# Altium project MB1136.PrjPCB
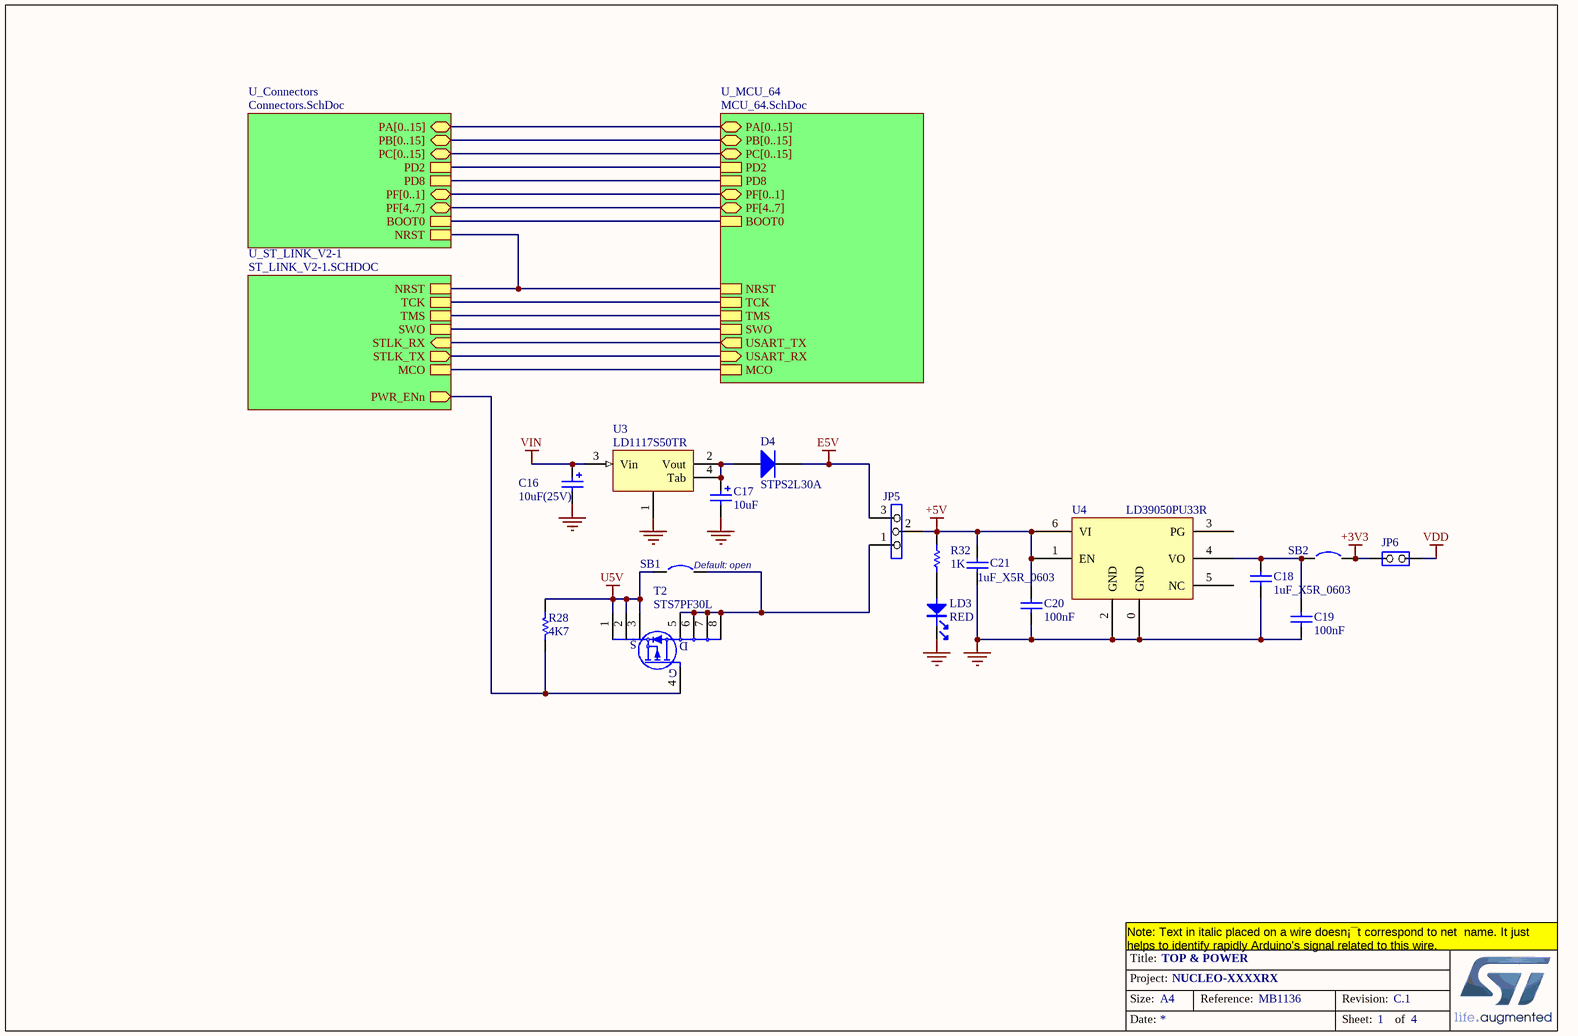
[diagram p0: MB1136.SchDoc]
4 sheets, 172 parts. Net scope: hierarchical (ports join the sheet entries above them; power ports are global).
Board files: MB1136.PcbDoc, Nucleo_64_mechanic_revC.PcbDoc
Sheets:
  MB1136.SchDoc
    U_ST_LINK_V2-1 = ST_LINK_V2-1.SCHDOC
    U_Connectors = Connectors.SchDoc
    U_MCU_64 = MCU_64.SchDoc

## Sheet MB1136.SchDoc: TOP & POWER
size A4; DocumentNumber: MB1136; Revision: C.1; SheetNumber: 1; SheetTotal: 4; Project: NUCLEO-XXXXRX

### Parts
C16  10uF(25V)  [TAN-B]
C17  10uF  [TAN-A]
C18  1uF_X5R_0603  [0603C]
C19  100nF  [0603C]
C20  100nF  [0603C]
C21  1uF_X5R_0603  [0603C]
D4  STPS2L30A  [SMA]
JP5  (no value)  [SIP3]
JP6  (no value)  [SIP2/2.54]
LD3  RED  [0603D]
R28  4K7  [0603R]
R32  1K  [0603R]
SB1  Circuit Breaker  [JP2_SMD]  (value not drawn)
SB2  Circuit Breaker  [JP2_SMD]  (value not drawn)
T2  STS7PF30L  [SO8]
U3  LD1117S50TR  [SOT-223]
U4  LD39050PU33R  [DFN6(3X3)]

### Sub-sheets
U_Connectors = Connectors.SchDoc: PA[0..15] (bidir), PB[0..15] (bidir), PC[0..15] (bidir), PF[4..7] (bidir), PD2, PD8, PF[0..1] (bidir), NRST, BOOT0
U_MCU_64 = MCU_64.SchDoc: NRST, MCO, USART_RX (in), USART_TX (out), PA[0..15] (bidir), PB[0..15] (bidir), PC[0..15] (bidir), PF[4..7] (bidir), PD2, TCK, TMS, SWO, PD8, PF[0..1] (bidir), BOOT0
U_ST_LINK_V2-1 = ST_LINK_V2-1.SCHDOC: TMS, TCK, MCO, NRST, STLK_RX (in), STLK_TX (out), SWO, PWR_ENn (out)

### Nets
+3V3: JP6.1(COMMON) SB2.2
+5V: C20.2 C21.1 JP5.2 R32.2 U4.1(EN) U4.6(VI)
E5V: D4.2(K) JP5.3
GND: C16.2 C17.2 C18.2 C19.1 C20.1 C21.2 LD3.2 U3.1 U4.0(GND) U4.2(GND)
U5V: R28.1 SB1.1 T2.1(S) T2.2(S) T2.3(S)
VDD: JP6.2(NO)
VIN: C16.1 U3.3(Vin)
BOOT0: sheet U_Connectors/BOOT0, sheet U_MCU_64/BOOT0
MCO: sheet U_ST_LINK_V2-1/MCO, sheet U_MCU_64/MCO
NRST: sheet U_ST_LINK_V2-1/NRST, sheet U_Connectors/NRST, sheet U_MCU_64/NRST
PA13: sheet U_ST_LINK_V2-1/TMS, sheet U_MCU_64/TMS
PA14: sheet U_ST_LINK_V2-1/TCK, sheet U_MCU_64/TCK
PB3: sheet U_ST_LINK_V2-1/SWO, sheet U_MCU_64/SWO
PD2: sheet U_Connectors/PD2, sheet U_MCU_64/PD2
PD8: sheet U_Connectors/PD8, sheet U_MCU_64/PD8
NetC17_1: C17.1 D4.1(A) U3.2(Vout) U3.4(Tab)
NetC18_1: C18.1 C19.2 SB2.1 U4.4(VO)
NetJP5_1: JP5.1 SB1.2 T2.5(D) T2.6(D) T2.7(D) T2.8(D)
NetLD3_1: LD3.1 R32.1
NetR28_2: R28.2 T2.4(G) ; sheet U_ST_LINK_V2-1/PWR_ENn
NetSB13_1: sheet U_ST_LINK_V2-1/STLK_RX, sheet U_MCU_64/USART_TX
NetSB14_1: sheet U_ST_LINK_V2-1/STLK_TX, sheet U_MCU_64/USART_RX

Not connected (* = marked no-connect by the designer): U4 3(PG) 5(NC)

### Buses and harness runs
bus sheet U_Connectors/PA[0..15] = sheet U_MCU_64/PA[0..15]
bus sheet U_Connectors/PB[0..15] = sheet U_MCU_64/PB[0..15]
bus sheet U_Connectors/PC[0..15] = sheet U_MCU_64/PC[0..15]
bus sheet U_Connectors/PF[0..1] = sheet U_MCU_64/PF[0..1]
bus sheet U_Connectors/PF[4..7] = sheet U_MCU_64/PF[4..7]

### Notes on the sheet
- (near SB1) Default: open
- Note: Text in italic placed on a wire doesn¡¯t correspond to net  name. It just helps to identify rapidly Arduino's signal related to this wire.
- Title:
- Project:
- Size:
- Date:
- A4
- Reference:
- Sheet:
- Revision:
- of

### Library data of the parts
C16 C17 = Cap Pol1: Polarized Capacitor (Radial); Published: 8-Jun-2000; Revision: July-2002: Re-released for DXP Platform.; Publisher: Altium Limited; Value: 10uF
C18 C21 = CAP SMD 0603  X5R 1µF 25V 10%: 0603  X5R 1µF; Rated voltage: 25V; Tolerance: 10%; Manufacturer: *; Manufacturer P/N: *; Order code Farnell: 1288202RL; Value: 1µF; Power: *; Technology: X5R; Temperature  Factor: *; Temperature Max: +125°C; Temperature Min: -55°C; STS Code: *
C19 C20 = Capacitor_ST: Capacitor 0402 / 0603 / 0805; Revision: July-2002: Re-released for DXP Platform.; Value: 100nF
D4 = STPS2L30A: Manuf_1: STM; Provided: ST; Order: BAT60JFILM; ECCN_US/EU: EAR99/NEC; Revision: July-2002: Re-released for DXP Platform.; Manuf_Part_1: BAT60JFILM; Distrib: ST
JP5 = Jumper3
JP6 = JP2
LD3 = PHOTO
R28 = Res1: Resistor; Value: 1K; Published: 8-Jun-2000; Revision: July-2002: Re-released for DXP Platform.; Publisher: Altium Limited
R32 = Resistor_ST: Resistor 0402 / 0603 / 0805; Description: Resistor 0402 or 0603 or 0805; Value: 10K
SB1 SB2 = Circuit Breaker: Solder: NO; Published: 24-Mar-1999; Revision: July-2002: Re-released for DXP Platform.; Publisher: Altium Limited
U3 = LD1117
U4 = LD39050P

## Sheet ST_LINK_V2-1.SCHDOC: STLINK/V2-1
size A4; DocumentNumber: MB1136; Revision: C.1; SheetNumber: 3; SheetTotal: 4; Project: NUCLEO-XXXXRX
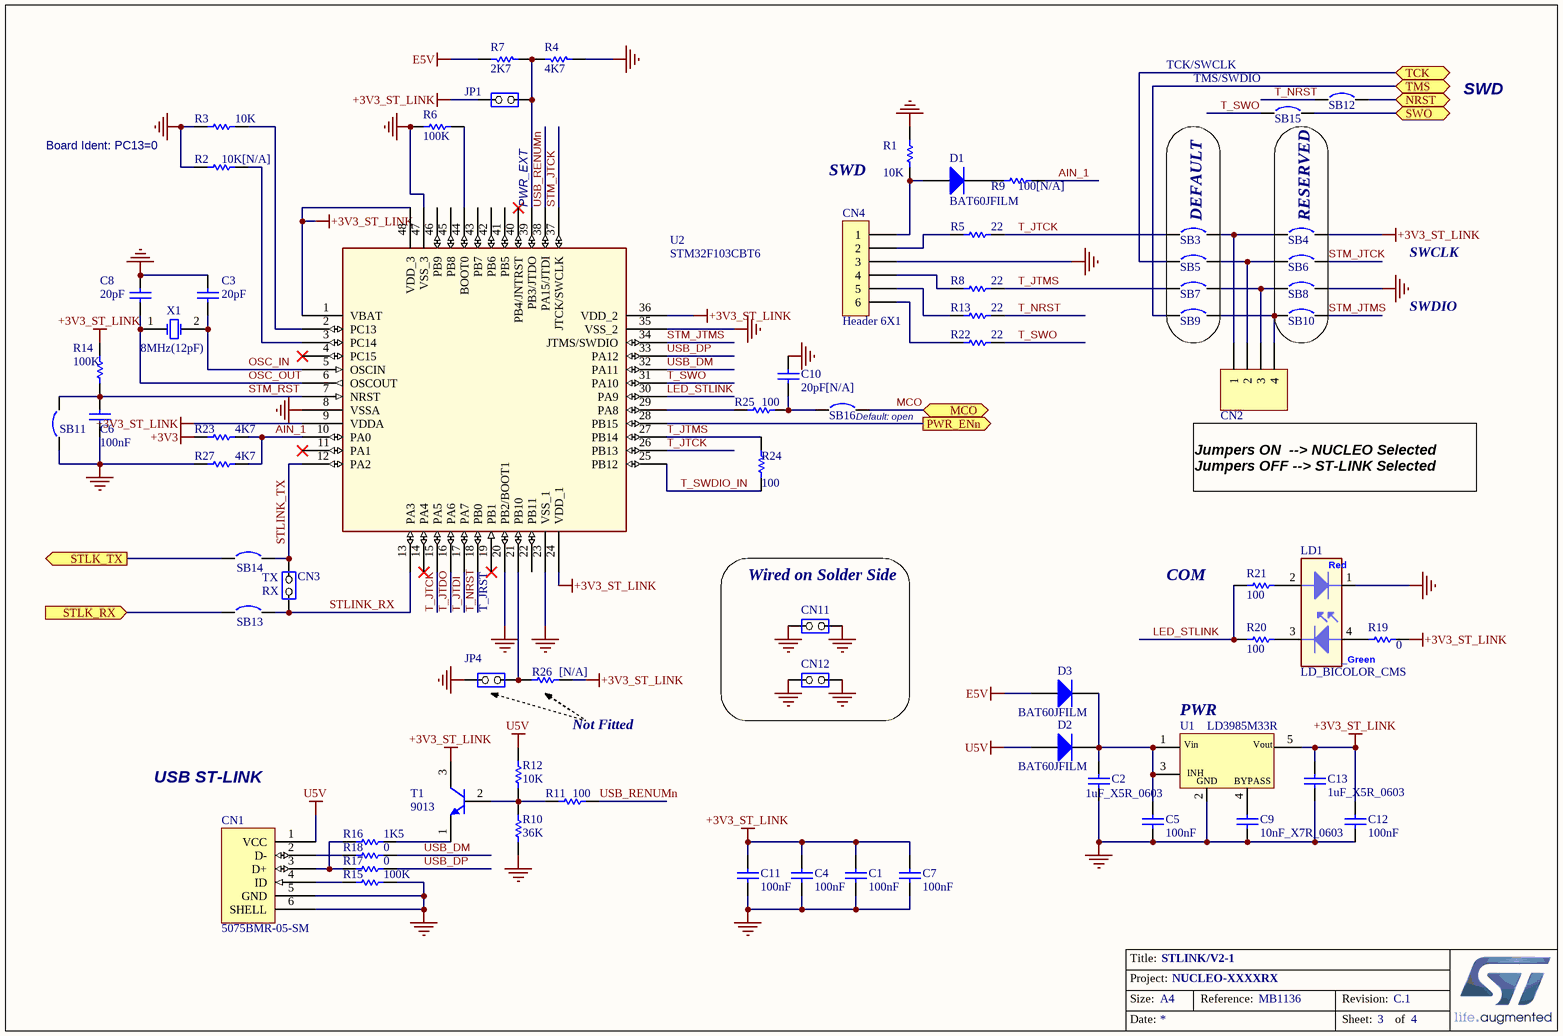
[diagram p1: ST_LINK_V2-1.SCHDOC]

### Parts
C1  100nF  [0603C]
C2  1uF_X5R_0603  [0603C]
C3  20pF  [0603C]
C4  100nF  [0603C]
C5  100nF  [0603C]
C6  100nF  [0603C]
C7  100nF  [0603C]
C8  20pF  [0603C]
C9  10nF_X7R_0603  [0603C]
C10  20pF[N/A]  [0603C]
C11  100nF  [0603C]
C12  100nF  [0603C]
C13  1uF_X5R_0603  [0603C]
CN1  5075BMR-05-SM  [USB-MINI-B-SMD]
CN2  Header 4  [1*4]  (value not drawn)
CN3  (no value)  [SIP2/2.54]
CN4  Header 6X1  [1*6P]
CN11  (no value)  [SIP2/2.54]
CN12  (no value)  [SIP2/2.54]
D1  BAT60JFILM  [SOD323/A]
D2  BAT60JFILM  [SOD323/A]
D3  BAT60JFILM  [SOD323/A]
JP1  (no value)  [SIP2/2.54]
JP4  (no value)  [SIP2/2.54]
LD1  LD_BICOLOR_CMS  [HSMF-A201]
R1  10K  [0603R]
R2  10K[N/A]  [0603R]
R3  10K  [0603R]
R4  4K7  [0603R]
R5  22  [0603R]
R6  100K  [0603R]
R7  2K7  [0603R]
R8  22  [0603R]
R9  100[N/A]  [0603R]
R10  36K  [0603R]
R11  100  [0603R]
R12  10K  [0603R]
R13  22  [0603R]
R14  100K  [0603R]
R15  100K  [0603R]
R16  1K5  [0603R]
R17  0  [0603R]
R18  0  [0603R]
R19  0  [0603R]
R20  100  [0603R]
R21  100  [0603R]
R22  22  [0603R]
R23  4K7  [0603R]
R24  100  [0603R]
R25  100  [0603R]
R26  [N/A]  [0603R]
R27  4K7  [0603R]
SB3  Circuit Breaker  [JP2_SMD]  (value not drawn)
SB4  Circuit Breaker  [JP2_SMD]  (value not drawn)
SB5  Circuit Breaker  [JP2_SMD]  (value not drawn)
SB6  Circuit Breaker  [JP2_SMD]  (value not drawn)
SB7  Circuit Breaker  [JP2_SMD]  (value not drawn)
SB8  Circuit Breaker  [JP2_SMD]  (value not drawn)
SB9  Circuit Breaker  [JP2_SMD]  (value not drawn)
SB10  Circuit Breaker  [JP2_SMD]  (value not drawn)
SB11  Circuit Breaker  [JP2_SMD]  (value not drawn)
SB12  Circuit Breaker  [JP2_SMD]  (value not drawn)
SB13  Circuit Breaker  [JP2_SMD]  (value not drawn)
SB14  Circuit Breaker  [JP2_SMD]  (value not drawn)
SB15  Circuit Breaker  [JP2_SMD]  (value not drawn)
SB16  Circuit Breaker  [JP2_SMD]  (value not drawn)
T1  9013  [SOT-23]
U1  LD3985M33R  [SOT-23-5L]
U2  STM32F103CBT6  [QFP48 7X7]
X1  8MHz(12pF)  [XTAL1]

### Blocks framed on the sheet
DEFAULT: SB3 SB5 SB7 SB9
RESERVED: SB4 SB6 SB8 SB10
Wired on Solder Side: CN11 CN12

### Ports
MCO, NRST, PWR_ENn (out), STLK_RX (in), STLK_TX (out), SWO, TCK, TMS

### Nets
+3V3: R23.1
+3V3_ST_LINK: C1.2 C4.2 C7.2 C11.2 C12.2 C13.1 JP1.1(COMMON) R14.2 R19.2 R26.1 SB4.2 T1.3(C) U1.5(Vout) U2.1(VBAT) U2.9(VDDA) U2.24(VDD_1) U2.36(VDD_2) U2.48(VDD_3)
E5V: D3.1(A) R7.1
GND: C1.1 C2.1 C3.2 C4.1 C5.1 C6.1 C7.1 C8.2 C9.1 C10.2 C11.1 C12.1 C13.2 CN1.5(GND) CN1.6(SHELL) CN4.3 CN11.1(COMMON) CN11.2(NO) CN12.1(COMMON) CN12.2(NO) JP4.1(COMMON) LD1.1 R1.2 R2.1 R3.1 R4.2 R6.1 R10.1 R15.2 R27.1 SB8.2 SB11.1 U1.2(GND) U2.8(VSSA) U2.20(PB2/BOOT1) U2.23(VSS_1) U2.35(VSS_2) U2.47(VSS_3)
U5V: CN1.1(VCC) D2.1(A) R12.2
AIN_1: R9.2 R23.2 R27.2 U2.10(PA0)
LED_STLINK: R20.1 R21.1 U2.30(PA9)
MCO: SB16.2 ; port MCO
NRST: SB12.2 ; port NRST
OSC_IN: C3.1 U2.5(OSCIN) X1.2(OSC2)
OSC_OUT: C8.1 U2.6(OSCOUT) X1.1(OSC1)
PA13: SB9.1 ; port TMS
PA14: SB5.1 ; port TCK
PB3: SB15.2 ; port SWO
STLINK_RX: CN3.1(COMMON) SB13.2 U2.13(PA3)
STLINK_TX: CN3.2(NO) SB14.2 U2.12(PA2)
STM_JTCK: SB6.2 U2.37(JTCK/SWCLK)
STM_JTMS: SB10.2 U2.34(JTMS/SWDIO)
STM_RST: C6.2 R14.1 SB11.2 U2.7(NRST)
T_JTCK: R5.2 SB3.1 U2.15(PA5) U2.26(PB13)
T_JTDI: U2.17(PA7)
T_JTDO: U2.16(PA6)
T_JTMS: R8.2 R24.2 SB7.1 U2.27(PB14)
T_NRST: R13.2 SB12.1 U2.18(PB0)
T_SWDIO_IN: R24.1 U2.25(PB12)
T_SWO: R22.2 SB15.1 U2.31(PA10)
USB_DM: R18.2 U2.32(PA11)
USB_DP: R17.2 U2.33(PA12)
USB_RENUMn: R11.2 U2.38(PA15/JTDI)
NetC2_2: C2.2 C5.2 D2.2(K) D3.2(K) U1.1(Vin) U1.3(CE)
NetC9_2: C9.2 U1.4(BYPASS)
NetC10_1: C10.1 R25.2 SB16.1
NetCN1_2: CN1.2(D-) R18.1
NetCN1_3: CN1.3(D+) R16.1 R17.1
NetCN1_4: CN1.4(ID) R15.1
NetCN2_1: CN2.1 SB3.2 SB4.1
NetCN2_2: CN2.2 SB5.2 SB6.1
NetCN2_3: CN2.3 SB7.2 SB8.1
NetCN2_4: CN2.4 SB9.2 SB10.1
NetCN4_1: CN4.1 D1.1(A) R1.1
NetCN4_2: CN4.2 R5.1
NetCN4_4: CN4.4 R8.1
NetCN4_5: CN4.5 R13.1
NetCN4_6: CN4.6 R22.1
NetD1_2: D1.2(K) R9.1
NetJP1_2: JP1.2(NO) R4.1 R7.2 U2.39(PB3/JTDO)
NetJP4_2: JP4.2(NO) R26.2 U2.21(PB10)
NetLD1_2: LD1.2 R21.2
NetLD1_3: LD1.3 R20.2
NetLD1_4: LD1.4 R19.1
NetR2_2: R2.2 U2.3(PC14)
NetR3_2: R3.2 U2.2(PC13)
NetR6_2: R6.2 U2.44(BOOT0)
NetR10_2: R10.2 R11.1 R12.1 T1.2(B)
NetR16_2: R16.2 T1.1(E)
NetR25_1: R25.1 U2.29(PA8)
NetR28_2: U2.28(PB15) ; port PWR_ENn
NetSB13_1: SB13.1 ; port STLK_RX
NetSB14_1: SB14.1 ; port STLK_TX

Not connected (* = marked no-connect by the designer): U2 4(PC15)* 11(PA1)* 14(PA4)* 19(PB1)* 22(PB11) 40(PB4/JNTRST)* 41(PB5) 42(PB6) 43(PB7) 45(PB8) 46(PB9)

### Notes on the sheet
- TCK/SWCLK
- (near SB15) TMS/SWDIO
- SWD
- Board Ident: PC13=0
- (near U2) PWR_EXT
- SWCLK
- SWDIO
- (near SB16) Default: open
- Jumpers ON  --> NUCLEO Selected
  Jumpers OFF --> ST-LINK Selected
- TX
- COM
- RX
- T_JRST
- (near U1) PWR
- USB ST-LINK
- Not Fitted
- Title:
- Project:
- Size:
- Date:
- A4
- Reference:
- Sheet:
- Revision:
- of
- (in symbol LD3985M33R) INH
- (in symbol LD_BICOLOR_CMS) Red; _Green

### Library data of the parts
C1 C4-C7 C11 C12 = Capacitor_ST: Capacitor 0402 / 0603 / 0805; Revision: July-2002: Re-released for DXP Platform.; Value: 100nF
C2 C13 = CAP SMD 0603  X5R 1µF 25V 10%: as C18 on sheet MB1136; Manufacturer: *; Manufacturer P/N: *; Order code Farnell: 1288202RL; Value: 1µF; Power: *; Technology: X5R; Temperature  Factor: *; Temperature Max: +125°C; Temperature Min: -55°C; STS Code: *
C3 C8 C10 = Capacitor_ST: Capacitor 0402 / 0603 / 0805; Value: 100nF; Revision: July-2002: Re-released for DXP Platform.
C9 = CAP SMD 0603  X7R 10000PF 50V 10%: 0603  X7R 10NF; Order code RS: 2040779; Rated voltage: 50V; Tolerance: 10%; Order code Farnell: 7569548RL; Value: 10NF; Power: *; Technology: X7R; Temperature Factor: *; Temperature Min: -55°C; Temperature Max: +125°C; STS Code: *
CN1 = USB-MINI-typeB connector: Manuf_Part_1: 5075BMR-05-SM; Order: 5075BMR-05-SM; Description: USB-MINI-typeB connector; ECCN: ????
CN2 = Header 4: Header, 4-Pin, Single row; Revision: 17-Jul-2002: Re-released for DXP Platform.; Publisher: Altium Limited
CN3 = JP2: Fitted: NO
CN4 = Header 6X1: Header, 6-Pin, Single row; LatestRevisionDate: 17-Jul-2002; LatestRevisionNote: Re-released for DXP Platform.; Publisher: Altium Limited
CN11 CN12 JP1 JP4 = JP2
D1-D3 = BAT60JFILM: Manuf_1: STM; Provided: ST; ECCN_US/EU: EAR99/NEC; Revision: July-2002: Re-released for DXP Platform.; Order: BAT60JFILM; Manuf_Part_1: BAT60JFILM; Distrib: ST
LD1 = LD_BICOLOR_CMS: Bicolor Led; Manuf_Part_1: HSMF-A201-A00J1; Manuf_1: Avago Technologies; Ref St: xxxxxx; cap_dec: ----; Distrib: RADIOSPARES
R1 R3 = Resistor_ST: Resistor 0402 / 0603 / 0805; Description: Resistor 0402 or 0603 or 0805; Value: 10K
R2 R23 R27 = Resistor_ST: Resistor 0402 / 0603 / 0805; Description: Resistor 0402 or 0603 or 0805; Value: 10K; Fitted: NO
R4 R7 R10 R12 R26 = Res1: Resistor; Value: 1K; Published: 8-Jun-2000; Revision: July-2002: Re-released for DXP Platform.; Publisher: Altium Limited
R5 R6 R8 R9 R11 R13-R22 R24 R25 = Resistor_ST: as R32 on sheet MB1136
SB3 SB5 SB7 SB9 SB11 SB13-SB16 = Circuit Breaker: Solder: NO; Published: 24-Mar-1999; Revision: July-2002: Re-released for DXP Platform.; Publisher: Altium Limited
SB4 SB6 SB8 SB10 SB12 = Circuit Breaker: Solder: YES; Published: 24-Mar-1999; Revision: July-2002: Re-released for DXP Platform.; Publisher: Altium Limited
T1 = NPN: NPN Bipolar Transistor; Code - JEDEC: TO-226-AA; Published: 8-Jun-2000; Revision: July-2002: Re-released for DXP Platform.; Publisher: Altium Limited
U1 = LD3985M33R: Ultra low drop-low noise BiCMOS voltage, regulators low ESR capacitors compatible; Manuf_1: STM; Provided: ST; Ref St: 9176161; ECCN_US/EU: EAR99/NEC; Manuf_Part_1: LD3985M33R; Distrib: ST; Order: LD3985M33R
U2 = STM32F103CBT6: Medium-density performance line ARM-based 32-bit MCU with 64KB Flash; Manuf_Part_1: STM32F103C8T6; Manuf_1: STM; Ref St: 9175981; Provided: ST; ECCN_US/EU: 3A991A2/NEC; Distrib: ST; Order: STM32F103C8T6
X1 = XTAL: Crystal Oscillator; Published: 8-Jun-2000; LatestRevisionDate: 17-Jul-2002; LatestRevisionNote: Re-released for DXP Platform.; PackageReference: R38; Publisher: Altium Limited

## Sheet Connectors.SchDoc: Extension connectors
size A4; DocumentNumber: MB1136; Revision: C.1; SheetNumber: 4; SheetTotal: 4; Project: NUCLEO-XXXXRX
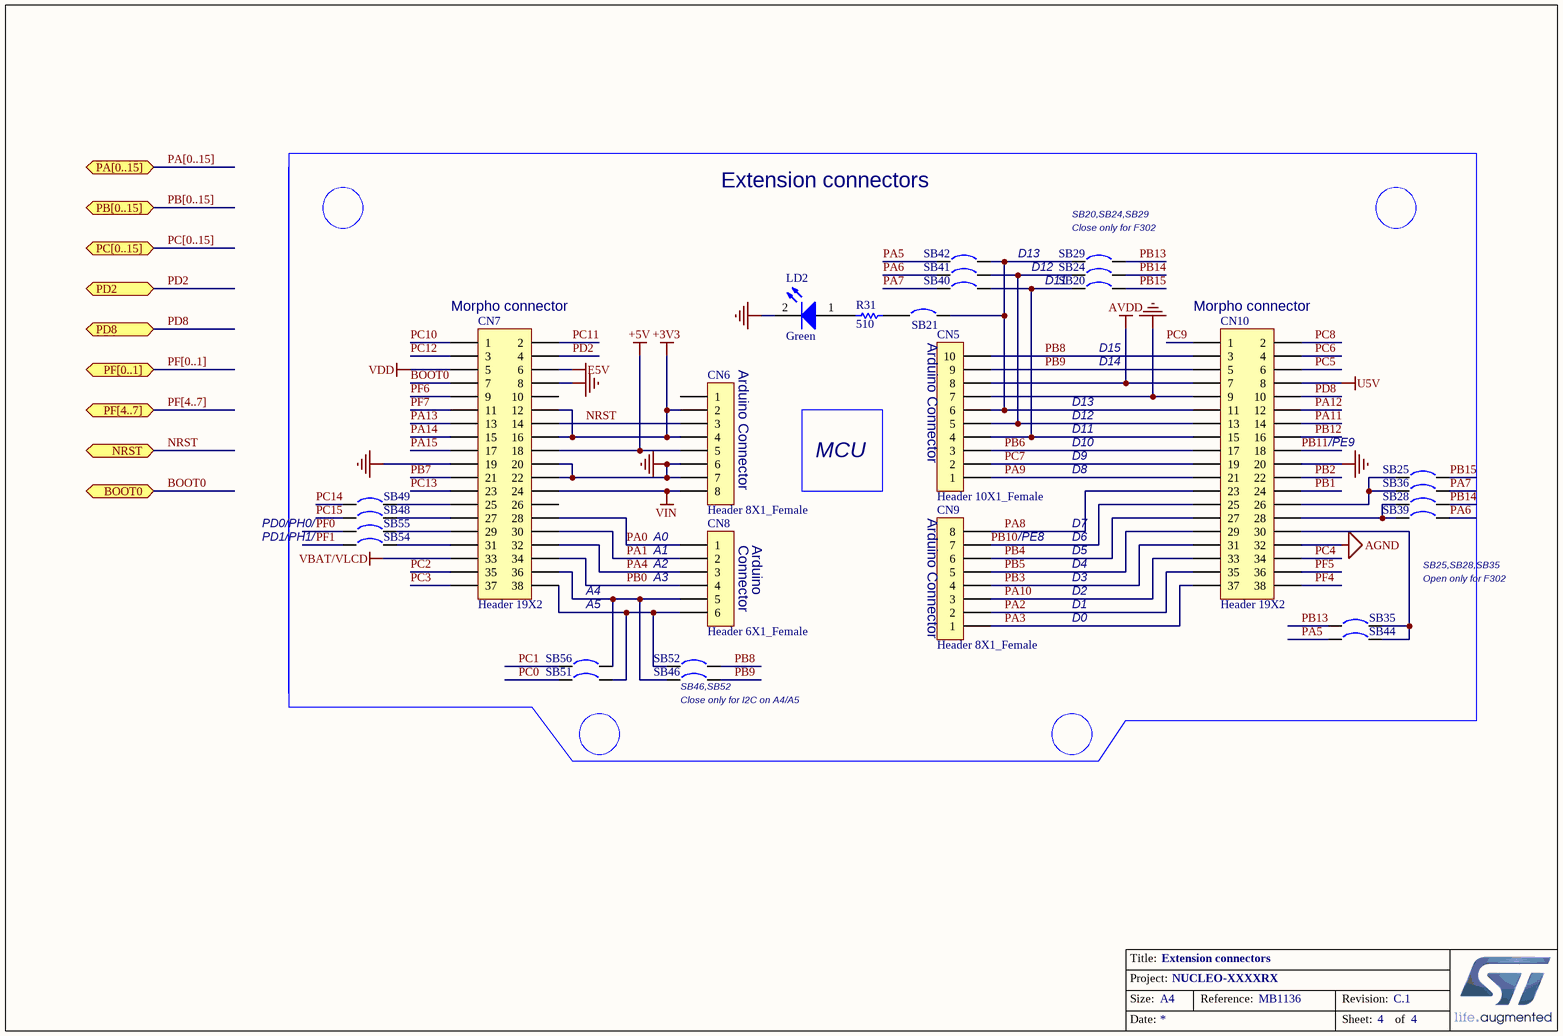
[diagram p2: Connectors.SchDoc]

### Parts
CN5  Header 10X1_Female  [1*10P_FEMALE]
CN6  Header 8X1_Female  [1*8P_FEMALE]
CN7  Header 19X2  [2*19P]
CN8  Header 6X1_Female  [1*6P_FEMALE]
CN9  Header 8X1_Female  [1*8P_FEMALE]
CN10  Header 19X2  [2*19P]
LD2  Green  [0603D]
R31  510  [0603R]
SB20  Circuit Breaker  [JP2_SMD]  (value not drawn)
SB21  Circuit Breaker  [JP2_SMD]  (value not drawn)
SB24  Circuit Breaker  [JP2_SMD]  (value not drawn)
SB25  Circuit Breaker  [JP2_SMD]  (value not drawn)
SB28  Circuit Breaker  [JP2_SMD]  (value not drawn)
SB29  Circuit Breaker  [JP2_SMD]  (value not drawn)
SB35  Circuit Breaker  [JP2_SMD]  (value not drawn)
SB36  Circuit Breaker  [JP2_SMD]  (value not drawn)
SB39  Circuit Breaker  [JP2_SMD]  (value not drawn)
SB40  Circuit Breaker  [JP2_SMD]  (value not drawn)
SB41  Circuit Breaker  [JP2_SMD]  (value not drawn)
SB42  Circuit Breaker  [JP2_SMD]  (value not drawn)
SB44  Circuit Breaker  [JP2_SMD]  (value not drawn)
SB46  Circuit Breaker  [JP2_SMD]  (value not drawn)
SB48  Circuit Breaker  [JP2_SMD]  (value not drawn)
SB49  Circuit Breaker  [JP2_SMD]  (value not drawn)
SB51  Circuit Breaker  [JP2_SMD]  (value not drawn)
SB52  Circuit Breaker  [JP2_SMD]  (value not drawn)
SB54  Circuit Breaker  [JP2_SMD]  (value not drawn)
SB55  Circuit Breaker  [JP2_SMD]  (value not drawn)
SB56  Circuit Breaker  [JP2_SMD]  (value not drawn)

### Ports
BOOT0, NRST, PA[0..15] (bidir), PB[0..15] (bidir), PC[0..15] (bidir), PD2, PD8, PF[0..1] (bidir), PF[4..7] (bidir)

### Nets
+3V3: CN6.2 CN6.4 CN7.12 CN7.16
+5V: CN6.5 CN7.18
AGND: CN10.32
AVDD: CN5.8 CN10.7
E5V: CN7.6
GND: CN5.7 CN6.6 CN6.7 CN7.8 CN7.19 CN7.20 CN7.22 CN10.9 CN10.20 LD2.2(K)
U5V: CN10.8
VBAT/VLCD: CN7.33
VDD: CN7.5
VIN: CN6.8 CN7.24
BOOT0: CN7.7 ; port BOOT0
NRST: CN6.3 CN7.14 ; port NRST
PA0: CN7.28 CN8.1
PA1: CN7.30 CN8.2
PA2: CN9.2 CN10.35
PA3: CN9.1 CN10.37
PA4: CN7.32 CN8.3
PA5: SB42.1 SB44.2
PA6: SB39.1 SB41.1
PA7: SB36.1 SB40.1
PA8: CN9.8 CN10.23
PA9: CN5.1 CN10.21
PA10: CN9.3 CN10.33
PA11: CN10.14
PA12: CN10.12
PA13: CN7.13
PA14: CN7.15
PA15: CN7.17
PB0: CN7.34 CN8.4
PB1: CN10.24
PB2: CN10.22
PB3: CN9.4 CN10.31
PB4: CN9.6 CN10.27
PB5: CN9.5 CN10.29
PB6: CN5.3 CN10.17
PB7: CN7.21
PB8: CN5.10 CN10.3 SB52.2
PB9: CN5.9 CN10.5 SB46.2
PB10: CN9.7 CN10.25
PB11: CN10.18
PB12: CN10.16
PB13: SB29.2 SB35.2
PB14: SB24.2 SB28.1
PB15: SB20.2 SB25.1
PC0: SB51.1
PC1: SB56.1
PC2: CN7.35
PC3: CN7.37
PC4: CN10.34
PC5: CN10.6
PC6: CN10.4
PC7: CN5.2 CN10.19
PC8: CN10.2
PC9: CN10.1
PC10: CN7.1
PC11: CN7.2
PC12: CN7.3
PC13: CN7.23
PC14: SB49.2
PC15: SB48.2
PD2: CN7.4 ; port PD2
PD8: CN10.10 ; port PD8
PF0: SB55.2
PF1: SB54.2
PF4: CN10.38
PF5: CN10.36
PF6: CN7.9
PF7: CN7.11
NetCN5_4: CN5.4 CN10.15 SB20.1 SB40.2
NetCN5_5: CN5.5 CN10.13 SB24.1 SB41.2
NetCN5_6: CN5.6 CN10.11 SB21.2 SB29.1 SB42.2
NetCN7_25: CN7.25 SB49.1
NetCN7_27: CN7.27 SB48.1
NetCN7_29: CN7.29 SB55.1
NetCN7_31: CN7.31 SB54.1
NetCN7_36: CN7.36 CN8.5 SB46.1 SB56.2
NetCN7_38: CN7.38 CN8.6 SB51.2 SB52.1
NetCN10_26: CN10.26 SB25.2 SB36.2
NetCN10_28: CN10.28 SB28.2 SB39.2
NetCN10_30: CN10.30 SB35.1 SB44.1
NetLD2_1: LD2.1(A) R31.2
NetR31_1: R31.1 SB21.1

Not connected (* = marked no-connect by the designer): CN6 1; CN7 10 26

### Buses and harness runs
bus PA[0..15] = port PA[0..15]
bus PB[0..15] = port PB[0..15]
bus PC[0..15] = port PC[0..15]
bus PF[0..1] = port PF[0..1]
bus PF[4..7] = port PF[4..7]

### Notes on the sheet
- Extension connectors
- Close only for F302
- SB20,SB24,SB29
- (near CN7) Morpho connector
- D13
- D12
- D11
- (near CN10) Morpho connector
- (near CN6) Arduino Connector
- Arduino Connector
- D14
- D15
- D10
- /PE9
- MCU
- (near CN9) Arduino Connector
- D8
- D9
- PD0/PH0/
- PD1/PH1/
- A0
- (near CN8) A1
- (near CN8) A2
- (near CN8) A3
- (near CN8) Connector
- (near CN8) Arduino
- /PE8
- D4
- D3
- D5
- D6
- D7
- Open only for F302
- SB25,SB28,SB35
- A4
- A5
- D0
- D1
- D2
- (near SB46) Close only for I2C on A4/A5
- (near SB46) SB46,SB52
- Title:
- Project:
- Size:
- Date:
- Reference:
- Sheet:
- Revision:
- of

### Library data of the parts
CN5 = Header 10X1_Female: Header, 10-Pin, Single row,female; LatestRevisionDate: 17-Jul-2002; LatestRevisionNote: Re-released for DXP Platform.; Publisher: Altium Limited
CN6 CN9 = Header 8X1_Female: Header, 8-Pin, Single row,female; LatestRevisionDate: 17-Jul-2002; LatestRevisionNote: Re-released for DXP Platform.; Publisher: Altium Limited
CN7 CN10 = Header 19X2: Header, 19-Pin, Dual row; Revision: 17-Jul-2002: Re-released for DXP Platform.; Publisher: Altium Limited
CN8 = Header 6X1_Female: Header, 6-Pin, Single row,female; LatestRevisionDate: 17-Jul-2002; LatestRevisionNote: Re-released for DXP Platform.; Publisher: Altium Limited
LD2 = LED2: Typical RED, GREEN, YELLOW, AMBER GaAs LED; Published: 8-Jun-2000; Revision: July-2002: Re-released for DXP Platform.; Publisher: Altium Limited
R31 = Res1: Resistor; Value: 1K; Published: 8-Jun-2000; Revision: July-2002: Re-released for DXP Platform.; Publisher: Altium Limited
SB20 SB21 SB24 SB25 SB28 SB29 SB35 SB36 SB39-SB42 SB44 SB46 SB48 SB49 SB51 SB52 SB54-SB56 = Circuit Breaker: Solder: NO; Published: 24-Mar-1999; Revision: July-2002: Re-released for DXP Platform.; Publisher: Altium Limited

## Sheet MCU_64.SchDoc: MCU
size A4; DocumentNumber: MB1136; Revision: C.1; SheetNumber: 2; SheetTotal: 4; Project: NUCLEO-XXXXRX
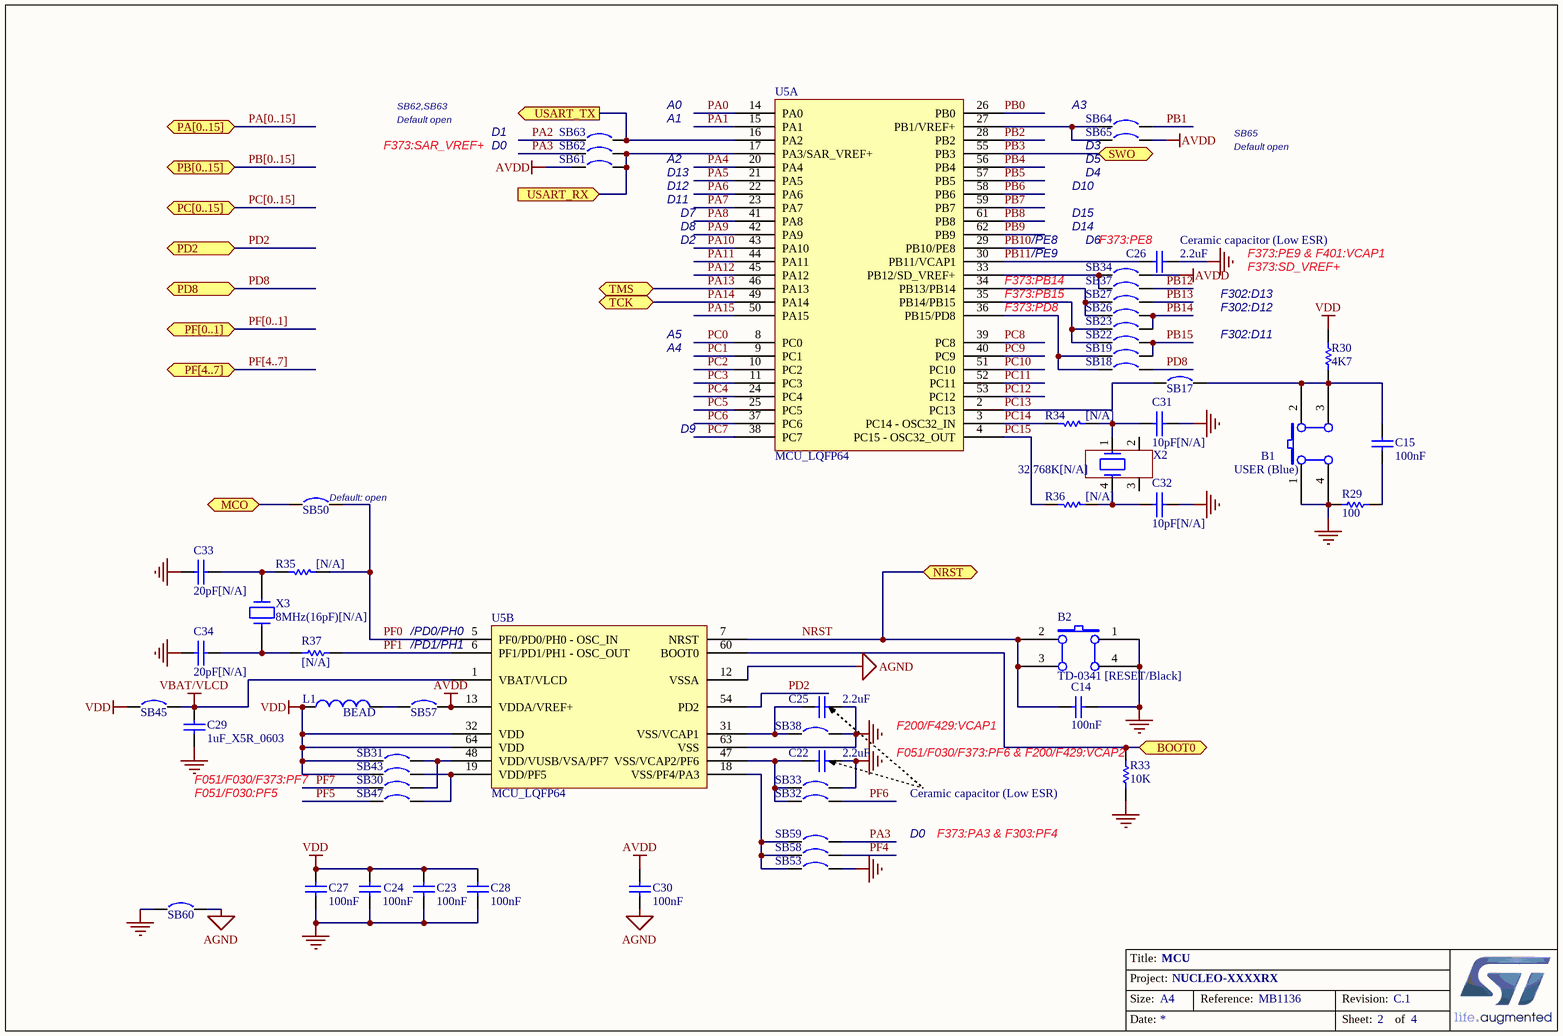
[diagram p3: MCU_64.SchDoc]

### Parts
B1  USER (Blue)  [PB10]
B2  TD-0341 [RESET/Black]  [PB10]
C14  100nF  [0603C]
C15  100nF  [0603C]
C22  2.2uF  [TAN-A]
C23  100nF  [0603C]
C24  100nF  [0603C]
C25  2.2uF  [TAN-A]
C26  2.2uF  [TAN-A]
C27  100nF  [0603C]
C28  100nF  [0603C]
C29  1uF_X5R_0603  [0603C]
C30  100nF  [0603C]
C31  10pF[N/A]  [0603C]
C32  10pF[N/A]  [0603C]
C33  20pF[N/A]  [0603C]
C34  20pF[N/A]  [0603C]
L1  BEAD  [0603L]
R29  100  [0603R]
R30  4K7  [0603R]
R33  10K  [0603R]
R34  [N/A]  [0603R]
R35  [N/A]  [0603R]
R36  [N/A]  [0603R]
R37  [N/A]  [0603R]
SB17  Circuit Breaker  [JP2_SMD]  (value not drawn)
SB18  Circuit Breaker  [JP2_SMD]  (value not drawn)
SB19  Circuit Breaker  [JP2_SMD]  (value not drawn)
SB22  Circuit Breaker  [JP2_SMD]  (value not drawn)
SB23  Circuit Breaker  [JP2_SMD]  (value not drawn)
SB26  Circuit Breaker  [JP2_SMD]  (value not drawn)
SB27  Circuit Breaker  [JP2_SMD]  (value not drawn)
SB30  Circuit Breaker  [JP2_SMD]  (value not drawn)
SB31  Circuit Breaker  [JP2_SMD]  (value not drawn)
SB32  Circuit Breaker  [JP2_SMD]  (value not drawn)
SB33  Circuit Breaker  [JP2_SMD]  (value not drawn)
SB34  Circuit Breaker  [JP2_SMD]  (value not drawn)
SB37  Circuit Breaker  [JP2_SMD]  (value not drawn)
SB38  Circuit Breaker  [JP2_SMD]  (value not drawn)
SB43  Circuit Breaker  [JP2_SMD]  (value not drawn)
SB45  Circuit Breaker  [JP2_SMD]  (value not drawn)
SB47  Circuit Breaker  [JP2_SMD]  (value not drawn)
SB50  Circuit Breaker  [JP2_SMD]  (value not drawn)
SB53  Circuit Breaker  [JP2_SMD]  (value not drawn)
SB57  Circuit Breaker  [JP2_SMD]  (value not drawn)
SB58  Circuit Breaker  [JP2_SMD]  (value not drawn)
SB59  Circuit Breaker  [JP2_SMD]  (value not drawn)
SB60  Circuit Breaker  [JP2_SMD]  (value not drawn)
SB61  Circuit Breaker  [JP2_SMD]  (value not drawn)
SB62  Circuit Breaker  [JP2_SMD]  (value not drawn)
SB63  Circuit Breaker  [JP2_SMD]  (value not drawn)
SB64  Circuit Breaker  [JP2_SMD]  (value not drawn)
SB65  Circuit Breaker  [JP2_SMD]  (value not drawn)
U5  MCU_LQFP64  [LQFP64]  (parts A,B of 2)
X2  32.768K[N/A]  [XTAL_4SM_8X3R8]
X3  8MHz(16pF)[N/A]  [XTAL1]

### Ports
BOOT0, MCO, NRST, PA[0..15] (bidir), PB[0..15] (bidir), PC[0..15] (bidir), PD2, PD8, PF[0..1] (bidir), PF[4..7] (bidir), SWO, TCK, TMS, USART_RX (in), USART_TX (out)

### Nets
AGND: C30.2 SB60.2 U5.12(VSSA)
AVDD: C30.1 SB34.2 SB57.2 SB61.1 SB65.2 U5.13(VDDA/VREF+)
GND: B1.1(A0) B1.4(A1) B2.1(A0) B2.4(A1) C14.1 C22.2 C23.2 C24.2 C25.2 C26.2 C27.2 C28.2 C29.2 C31.2 C32.2 C33.2 C34.2 R29.1 R33.2 SB33.2 SB38.2 SB53.2 SB60.1 U5.63(VSS)
VBAT/VLCD: C29.1 SB45.2 U5.1(VBAT/VLCD)
VDD: C23.1 C24.1 C27.1 C28.1 L1.1 R30.2 SB31.1 SB43.1 SB45.1 U5.32(VDD) U5.64(VDD)
BOOT0: R33.1 U5.60(BOOT0) ; port BOOT0
MCO: SB50.1 ; port MCO
NRST: B2.2(B0) B2.3(B1) C14.2 U5.7(NRST) ; port NRST
PA0: U5.14(PA0)
PA1: U5.15(PA1)
PA2: SB63.1
PA3: SB59.2 SB62.1
PA4: U5.20(PA4)
PA5: U5.21(PA5)
PA6: U5.22(PA6)
PA7: U5.23(PA7)
PA8: U5.41(PA8)
PA9: U5.42(PA9)
PA10: U5.43(PA10)
PA11: U5.44(PA11)
PA12: U5.45(PA12)
PA13: U5.46(PA13) ; port TMS
PA14: U5.49(PA14) ; port TCK
PA15: U5.50(PA15)
PB0: U5.26(PB0)
PB1: SB64.2
PB2: U5.28(PB2)
PB3: U5.55(PB3) ; port SWO
PB4: U5.56(PB4)
PB5: U5.57(PB5)
PB6: U5.58(PB6)
PB7: U5.59(PB7)
PB8: U5.61(PB8)
PB9: U5.62(PB9)
PB10: U5.29(PB10/PE8)
PB11: C26.1 U5.30(PB11/VCAP1)
PB12: SB37.2
PB13: SB27.2
PB14: SB23.2 SB26.2
PB15: SB19.2 SB22.2
PC0: U5.8(PC0)
PC1: U5.9(PC1)
PC2: U5.10(PC2)
PC3: U5.11(PC3)
PC4: U5.24(PC4)
PC5: U5.25(PC5)
PC6: U5.37(PC6)
PC7: U5.38(PC7)
PC8: U5.39(PC8)
PC9: U5.40(PC9)
PC10: U5.51(PC10)
PC11: U5.52(PC11)
PC12: U5.53(PC12)
PC13: SB17.1 U5.2(PC13)
PC14: R34.2 U5.3(PC14_-_OSC32_IN)
PC15: R36.2 U5.4(PC15_-_OSC32_OUT)
PD2: U5.54(PD2) ; port PD2
PD8: SB18.2 ; port PD8
PF0: R35.1 SB50.2 U5.5(PF0/PD0/PH0_-_OSC_IN)
PF1: R37.1 U5.6(PF1/PD1/PH1_-_OSC_OUT)
PF4: SB58.2
PF5: SB47.1
PF6: SB32.2
PF7: SB30.1
NetB1_2: B1.2(B0) B1.3(B1) C15.2 R30.1 SB17.2
NetC15_1: C15.1 R29.2
NetC22_1: C22.1 SB32.1 SB33.1 U5.47(VSS/VCAP2/PF6)
NetC25_1: C25.1 SB38.1 U5.31(VSS/VCAP1)
NetC31_1: C31.1 R34.1 X2.1
NetC32_1: C32.1 R36.1 X2.4
NetC33_1: C33.1 R35.2 X3.2
NetC34_1: C34.1 R37.2 X3.1
NetL1_2: L1.2 SB57.1
NetSB13_1: SB63.2 U5.16(PA2) ; port USART_TX
NetSB14_1: SB61.2 SB62.2 U5.17(PA3/SAR_VREF+) ; port USART_RX
NetSB18_1: SB18.1 SB19.1 U5.36(PB15/PD8)
NetSB22_1: SB22.1 SB23.1 U5.35(PB14/PB15)
NetSB26_1: SB26.1 SB27.1 U5.34(PB13/PB14)
NetSB30_2: SB30.2 SB31.2 U5.48(VDD/VUSB/VSA/PF7)
NetSB34_1: SB34.1 SB37.1 U5.33(PB12/SD_VREF+)
NetSB43_2: SB43.2 SB47.2 U5.19(VDD/PF5)
NetSB53_1: SB53.1 SB58.1 SB59.1 U5.18(VSS/PF4/PA3)
NetSB64_1: SB64.1 SB65.1 U5.27(PB1/VREF+)

Not connected (* = marked no-connect by the designer): X2 2 3

### Buses and harness runs
bus PA[0..15] = port PA[0..15]
bus PB[0..15] = port PB[0..15]
bus PC[0..15] = port PC[0..15]
bus PF[0..1] = port PF[0..1]
bus PF[4..7] = port PF[4..7]

### Notes on the sheet
- SB62,SB63
- A0
- A3
- F373:SAR_VREF+
- Default open
- D0
- D1
- A1
- A2
- D13
- D4
- D3
- D5
- SB65
- D12
- D11
- D2
- D7
- D8
- /PE8
- D14
- D15
- D10
- D6
- (near C26) F373:PE8
- (near C26) Ceramic capacitor (Low ESR)
- F373:PB14
- F373:PB15
- F373:PD8
- /PE9
- F302:D12
- F302:D13
- F373:PE9 & F401:VCAP1
- F373:SD_VREF+
- A4
- A5
- F302:D11
- D9
- (near SB50) Default: open
- (near U5) /PD0/PH0
- (near U5) /PD1/PH1
- (near C29) F051/F030/F373:PF7
- F200/F429:VCAP1
- (near R33) F051/F030/F373:PF6 & F200/F429:VCAP2
- F051/F030:PF5
- Ceramic capacitor (Low ESR)
- F373:PA3 & F303:PF4
- Title:
- Project:
- Size:
- Date:
- Reference:
- Sheet:
- Revision:
- of

### Library data of the parts
B1 B2 = SW PUSHBUTTON: SE PUSHBUTTON
C14 C15 = CAP: Capacitor; Value: 100pF; Published: 8-Jun-2000; Revision: July-2002: Re-released for DXP Platform.; Publisher: Altium Limited
C22 C25 C26 = Cap_2.2uF_X7R_10%_0805: Capacitor,2.2uF,16V, X7R,10%,0805,YAGEO; Manuf_Part_1: CC0805KKX7R7BB225; Revision: July-2002: Re-released for DXP Platform.; Value: 2.2uF; Order: CC0805KKX7R7BB225; Manuf_1: YAGEO
C23 C24 C27 C28 C30 = Cap: Capacitor; Value: 10nF; Published: 8-Jun-2000; Revision: July-2002: Re-released for DXP Platform.; Publisher: Altium Limited
C29 = CAP SMD 0603  X5R 1µF 25V 10%: as C18 on sheet MB1136; Manufacturer: *; Manufacturer P/N: *; Order code Farnell: 1288202RL; Value: 1µF; Power: *; Technology: X5R; Temperature  Factor: *; Temperature Max: +125°C; Temperature Min: -55°C; STS Code: *
C31-C34 = CAP: Capacitor
L1 = Inductor: Value: 100uH; Published: 8-Jun-2000; Revision: July-2002: Re-released for DXP Platform.; Publisher: Altium Limited
R29 R34-R37 = Res1: Resistor; Value: 1K; Published: 8-Jun-2000; Revision: July-2002: Re-released for DXP Platform.; Publisher: Altium Limited
R30 R33 = res1: Resistor; Value: 1K; Published: 8-Jun-2000; Revision: July-2002: Re-released for DXP Platform.; Publisher: Altium Limited
SB17-SB19 SB22 SB23 SB26 SB27 SB30-SB34 SB37 SB38 SB43 SB45 SB47 SB50 SB53 SB57-SB65 = Circuit Breaker: Solder: NO; Published: 24-Mar-1999; Revision: July-2002: Re-released for DXP Platform.; Publisher: Altium Limited
X2 = MC306
X3 = CRYSTAL

## Nets that join several sheets
+3V3: MB1136 (JP6.1 SB2.2), ST_LINK_V2-1 (R23.1), Connectors (CN6.2 CN6.4 CN7.12 CN7.16)
+5V: MB1136 (6 pins), Connectors (CN6.5 CN7.18)
AGND: Connectors (CN10.32), MCU_64 (C30.2 SB60.2 U5.12)
AVDD: Connectors (CN5.8 CN10.7), MCU_64 (6 pins)
E5V: MB1136 (D4.2 JP5.3), ST_LINK_V2-1 (D3.1 R7.1), Connectors (CN7.6)
GND: MB1136 (10 pins), ST_LINK_V2-1 (38 pins), Connectors (10 pins), MCU_64 (24 pins)
U5V: MB1136 (5 pins), ST_LINK_V2-1 (CN1.1 D2.1 R12.2), Connectors (CN10.8)
VBAT/VLCD: Connectors (CN7.33), MCU_64 (C29.1 SB45.2 U5.1)
VDD: MB1136 (JP6.2), Connectors (CN7.5), MCU_64 (11 pins)
VIN: MB1136 (C16.1 U3.3), Connectors (CN6.8 CN7.24)
BOOT0: Connectors (CN7.7), MCU_64 (R33.1 U5.60)
MCO: ST_LINK_V2-1 (SB16.2), MCU_64 (SB50.1)
NetR28_2: MB1136 (R28.2 T2.4), ST_LINK_V2-1 (U2.28)
NetSB13_1: ST_LINK_V2-1 (SB13.1), MCU_64 (SB63.2 U5.16)
NetSB14_1: ST_LINK_V2-1 (SB14.1), MCU_64 (SB61.2 SB62.2 U5.17)
NRST: ST_LINK_V2-1 (SB12.2), Connectors (CN6.3 CN7.14), MCU_64 (B2.2 B2.3 C14.2 U5.7)
PA0: Connectors (CN7.28 CN8.1), MCU_64 (U5.14)
PA1: Connectors (CN7.30 CN8.2), MCU_64 (U5.15)
PA2: Connectors (CN9.2 CN10.35), MCU_64 (SB63.1)
PA3: Connectors (CN9.1 CN10.37), MCU_64 (SB59.2 SB62.1)
PA4: Connectors (CN7.32 CN8.3), MCU_64 (U5.20)
PA5: Connectors (SB42.1 SB44.2), MCU_64 (U5.21)
PA6: Connectors (SB39.1 SB41.1), MCU_64 (U5.22)
PA7: Connectors (SB36.1 SB40.1), MCU_64 (U5.23)
PA8: Connectors (CN9.8 CN10.23), MCU_64 (U5.41)
PA9: Connectors (CN5.1 CN10.21), MCU_64 (U5.42)
PA10: Connectors (CN9.3 CN10.33), MCU_64 (U5.43)
PA11: Connectors (CN10.14), MCU_64 (U5.44)
PA12: Connectors (CN10.12), MCU_64 (U5.45)
PA13: ST_LINK_V2-1 (SB9.1), Connectors (CN7.13), MCU_64 (U5.46)
PA14: ST_LINK_V2-1 (SB5.1), Connectors (CN7.15), MCU_64 (U5.49)
PA15: Connectors (CN7.17), MCU_64 (U5.50)
PB0: Connectors (CN7.34 CN8.4), MCU_64 (U5.26)
PB1: Connectors (CN10.24), MCU_64 (SB64.2)
PB2: Connectors (CN10.22), MCU_64 (U5.28)
PB3: ST_LINK_V2-1 (SB15.2), Connectors (CN9.4 CN10.31), MCU_64 (U5.55)
PB4: Connectors (CN9.6 CN10.27), MCU_64 (U5.56)
PB5: Connectors (CN9.5 CN10.29), MCU_64 (U5.57)
PB6: Connectors (CN5.3 CN10.17), MCU_64 (U5.58)
PB7: Connectors (CN7.21), MCU_64 (U5.59)
PB8: Connectors (CN5.10 CN10.3 SB52.2), MCU_64 (U5.61)
PB9: Connectors (CN5.9 CN10.5 SB46.2), MCU_64 (U5.62)
PB10: Connectors (CN9.7 CN10.25), MCU_64 (U5.29)
PB11: Connectors (CN10.18), MCU_64 (C26.1 U5.30)
PB12: Connectors (CN10.16), MCU_64 (SB37.2)
PB13: Connectors (SB29.2 SB35.2), MCU_64 (SB27.2)
PB14: Connectors (SB24.2 SB28.1), MCU_64 (SB23.2 SB26.2)
PB15: Connectors (SB20.2 SB25.1), MCU_64 (SB19.2 SB22.2)
PC0: Connectors (SB51.1), MCU_64 (U5.8)
PC1: Connectors (SB56.1), MCU_64 (U5.9)
PC2: Connectors (CN7.35), MCU_64 (U5.10)
PC3: Connectors (CN7.37), MCU_64 (U5.11)
PC4: Connectors (CN10.34), MCU_64 (U5.24)
PC5: Connectors (CN10.6), MCU_64 (U5.25)
PC6: Connectors (CN10.4), MCU_64 (U5.37)
PC7: Connectors (CN5.2 CN10.19), MCU_64 (U5.38)
PC8: Connectors (CN10.2), MCU_64 (U5.39)
PC9: Connectors (CN10.1), MCU_64 (U5.40)
PC10: Connectors (CN7.1), MCU_64 (U5.51)
PC11: Connectors (CN7.2), MCU_64 (U5.52)
PC12: Connectors (CN7.3), MCU_64 (U5.53)
PC13: Connectors (CN7.23), MCU_64 (SB17.1 U5.2)
PC14: Connectors (SB49.2), MCU_64 (R34.2 U5.3)
PC15: Connectors (SB48.2), MCU_64 (R36.2 U5.4)
PD2: Connectors (CN7.4), MCU_64 (U5.54)
PD8: Connectors (CN10.10), MCU_64 (SB18.2)
PF0: Connectors (SB55.2), MCU_64 (R35.1 SB50.2 U5.5)
PF1: Connectors (SB54.2), MCU_64 (R37.1 U5.6)
PF4: Connectors (CN10.38), MCU_64 (SB58.2)
PF5: Connectors (CN10.36), MCU_64 (SB47.1)
PF6: Connectors (CN7.9), MCU_64 (SB32.2)
PF7: Connectors (CN7.11), MCU_64 (SB30.1)